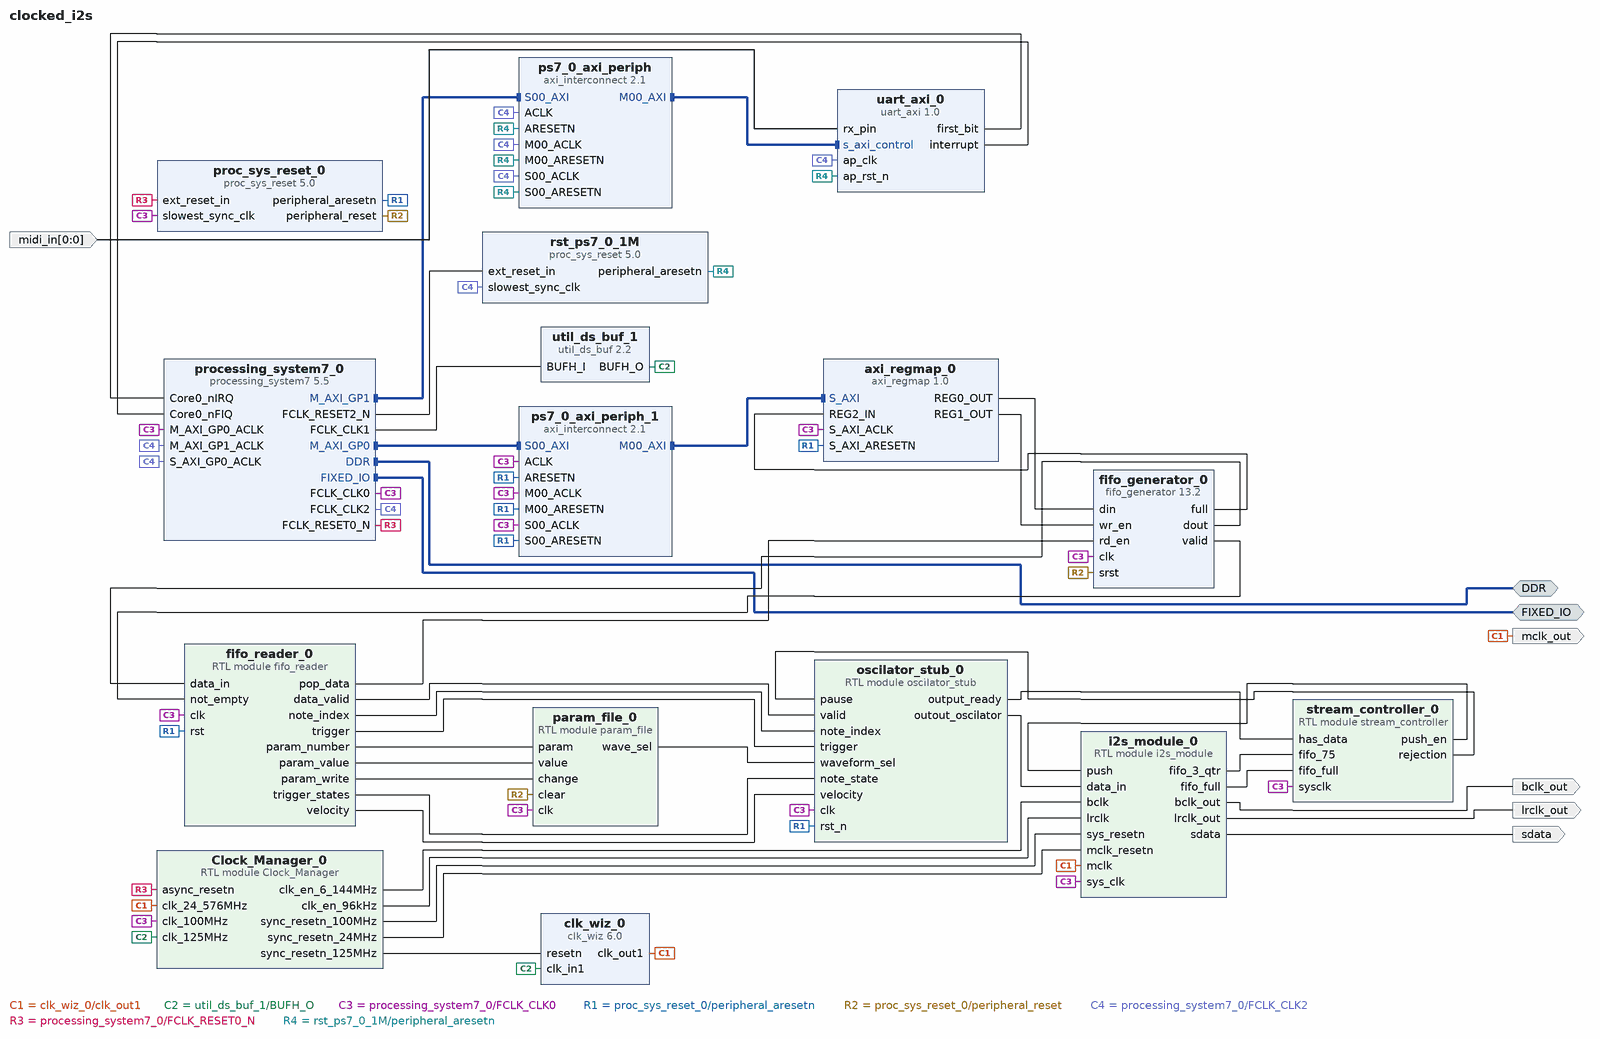
[diagram p0: block diagram of the top level]
# Vivado block design clocked_i2s, xc7z020clg400-1, Vivado 2021.1
create_bd_design clocked_i2s

create_bd_intf_port -mode Master -vlnv xilinx.com:interface:ddrx_rtl:1.0 DDR
create_bd_intf_port -mode Master -vlnv xilinx.com:display_processing_system7:fixedio_rtl:1.0 FIXED_IO
create_bd_port -dir O lrclk_out
create_bd_port -dir O bclk_out
create_bd_port -dir O sdata
create_bd_port -dir O -type clk mclk_out
create_bd_port -dir I -from 0 -to 0 -type data midi_in

create_bd_cell -type ip -vlnv xilinx.com:ip:clk_wiz:6.0 clk_wiz_0
set_property -dict [list \
  CONFIG.CLKIN1_JITTER_PS 80.0 \
  CONFIG.CLKOUT1_DRIVES BUFG \
  CONFIG.CLKOUT1_JITTER 554.143 \
  CONFIG.CLKOUT1_PHASE_ERROR 432.485 \
  CONFIG.CLKOUT1_REQUESTED_OUT_FREQ 24.57601 \
  CONFIG.FEEDBACK_SOURCE FDBK_AUTO \
  CONFIG.MMCM_CLKFBOUT_MULT_F 39.125 \
  CONFIG.MMCM_CLKIN1_PERIOD 8.000 \
  CONFIG.MMCM_CLKIN2_PERIOD 10.0 \
  CONFIG.MMCM_CLKOUT0_DIVIDE_F 24.875 \
  CONFIG.MMCM_DIVCLK_DIVIDE 8 \
  CONFIG.PRIM_IN_FREQ 125 \
  CONFIG.RESET_PORT resetn \
  CONFIG.RESET_TYPE ACTIVE_LOW \
  CONFIG.USE_LOCKED false \
] [get_bd_cells clk_wiz_0]
create_bd_cell -type ip -vlnv xilinx.com:ip:util_ds_buf:2.2 util_ds_buf_1
set_property -dict {CONFIG.C_BUF_TYPE BUFH} [get_bd_cells util_ds_buf_1]
create_bd_cell -type ip -vlnv xilinx.com:ip:processing_system7:5.5 processing_system7_0
set_property -dict [list \
  CONFIG.PCW_CORE0_FIQ_INTR 1 \
  CONFIG.PCW_CORE0_IRQ_INTR 1 \
  CONFIG.PCW_EN_CLK1_PORT 1 \
  CONFIG.PCW_EN_CLK2_PORT 1 \
  CONFIG.PCW_EN_RST2_PORT 1 \
  CONFIG.PCW_FCLK_CLK1_BUF TRUE \
  CONFIG.PCW_FCLK_CLK2_BUF TRUE \
  CONFIG.PCW_FPGA0_PERIPHERAL_FREQMHZ 100 \
  CONFIG.PCW_FPGA1_PERIPHERAL_FREQMHZ 125 \
  CONFIG.PCW_FPGA2_PERIPHERAL_FREQMHZ 1 \
  CONFIG.PCW_FPGA_FCLK1_ENABLE 1 \
  CONFIG.PCW_FPGA_FCLK2_ENABLE 1 \
  CONFIG.PCW_M_AXI_GP0_ENABLE_STATIC_REMAP 1 \
  CONFIG.PCW_M_AXI_GP0_THREAD_ID_WIDTH 6 \
  CONFIG.PCW_M_AXI_GP1_ENABLE_STATIC_REMAP 1 \
  CONFIG.PCW_M_AXI_GP1_THREAD_ID_WIDTH 6 \
  CONFIG.PCW_USE_FABRIC_INTERRUPT 1 \
  CONFIG.PCW_USE_M_AXI_GP1 1 \
  CONFIG.PCW_USE_S_AXI_GP0 1 \
] [get_bd_cells processing_system7_0]
# 30 more settings of processing_system7_0 are not shown: defaults, MIO pin electricals, DDR timing, and values the tool derives
create_bd_cell -type ip -vlnv xilinx.com:ip:proc_sys_reset:5.0 proc_sys_reset_0
create_bd_cell -type ip -vlnv xilinx.com:ip:fifo_generator:13.2 fifo_generator_0
set_property -dict [list \
  CONFIG.FIFO_Application_Type_rdch Data_FIFO \
  CONFIG.FIFO_Implementation_rach Common_Clock_Distributed_RAM \
  CONFIG.FIFO_Implementation_rdch Common_Clock_Distributed_RAM \
  CONFIG.FIFO_Implementation_wach Common_Clock_Distributed_RAM \
  CONFIG.FIFO_Implementation_wrch Common_Clock_Distributed_RAM \
  CONFIG.INTERFACE_TYPE Native \
  CONFIG.Input_Data_Width 16 \
  CONFIG.Input_Depth 32 \
  CONFIG.Input_Depth_rdch 32 \
  CONFIG.Output_Data_Width 16 \
  CONFIG.Performance_Options First_Word_Fall_Through \
  CONFIG.READ_WRITE_MODE READ_WRITE \
  CONFIG.Register_Slice_Mode_rdch Light_Weight \
  CONFIG.Reset_Type Synchronous_Reset \
  CONFIG.Use_Embedded_Registers false \
  CONFIG.Valid_Flag true \
  CONFIG.rach_type Pass_Through_Wire \
  CONFIG.rdch_type FIFO \
  CONFIG.wach_type Pass_Through_Wire \
  CONFIG.wdch_type Pass_Through_Wire \
  CONFIG.wrch_type Pass_Through_Wire \
] [get_bd_cells fifo_generator_0]
create_bd_cell -type ip -vlnv xilinx.com:ip:proc_sys_reset:5.0 rst_ps7_0_1M
create_bd_cell -type ip -vlnv xilinx.com:ip:axi_interconnect:2.1 ps7_0_axi_periph
set_property -dict {CONFIG.NUM_MI 1 CONFIG.NUM_SI 1} [get_bd_cells ps7_0_axi_periph]
create_bd_cell -type module -reference Clock_Manager Clock_Manager_0
create_bd_cell -type module -reference i2s_module i2s_module_0
create_bd_cell -type module -reference stream_controller stream_controller_0
create_bd_cell -type module -reference oscilator_stub oscilator_stub_0
create_bd_cell -type module -reference fifo_reader fifo_reader_0
create_bd_cell -type module -reference param_file param_file_0
create_bd_cell -type ip -vlnv xilinx.com:hls:uart_axi:1.0 uart_axi_0
create_bd_cell -type ip -vlnv SHREC:SHREC:axi_regmap:1.0 axi_regmap_0
set_property -dict {CONFIG.NUM_REGS 3 CONFIG.WIDTH0 16 CONFIG.WIDTH1 1 CONFIG.WIDTH2 1} [get_bd_cells axi_regmap_0]
create_bd_cell -type ip -vlnv xilinx.com:ip:axi_interconnect:2.1 ps7_0_axi_periph_1
set_property -dict {CONFIG.NUM_MI 1} [get_bd_cells ps7_0_axi_periph_1]

# ---- connections ----

connect_bd_intf_net [get_bd_intf_ports DDR] [get_bd_intf_pins processing_system7_0/DDR]
connect_bd_intf_net [get_bd_intf_ports FIXED_IO] [get_bd_intf_pins processing_system7_0/FIXED_IO]
connect_bd_intf_net [get_bd_intf_pins processing_system7_0/M_AXI_GP0] [get_bd_intf_pins ps7_0_axi_periph_1/S00_AXI]
connect_bd_intf_net [get_bd_intf_pins processing_system7_0/M_AXI_GP1] [get_bd_intf_pins ps7_0_axi_periph/S00_AXI]
connect_bd_intf_net [get_bd_intf_pins ps7_0_axi_periph_1/M00_AXI] [get_bd_intf_pins axi_regmap_0/S_AXI]
connect_bd_intf_net [get_bd_intf_pins ps7_0_axi_periph/M00_AXI] [get_bd_intf_pins uart_axi_0/s_axi_control]
connect_bd_net -net Clock_Manager_0_clk_en_12_288MHz [get_bd_pins Clock_Manager_0/clk_en_6_144MHz] [get_bd_pins i2s_module_0/bclk]
connect_bd_net [get_bd_pins Clock_Manager_0/clk_en_96kHz] [get_bd_pins i2s_module_0/lrclk]
connect_bd_net [get_bd_pins Clock_Manager_0/sync_resetn_100MHz] [get_bd_pins i2s_module_0/sys_resetn]
connect_bd_net [get_bd_pins Clock_Manager_0/sync_resetn_125MHz] [get_bd_pins clk_wiz_0/resetn]
connect_bd_net [get_bd_pins Clock_Manager_0/sync_resetn_24MHz] [get_bd_pins i2s_module_0/mclk_resetn]
connect_bd_net [get_bd_pins axi_regmap_0/REG0_OUT] [get_bd_pins fifo_generator_0/din]
connect_bd_net [get_bd_pins axi_regmap_0/REG1_OUT] [get_bd_pins fifo_generator_0/wr_en]
connect_bd_net [get_bd_pins clk_wiz_0/clk_out1] [get_bd_ports mclk_out] [get_bd_pins Clock_Manager_0/clk_24_576MHz] [get_bd_pins i2s_module_0/mclk]
connect_bd_net -net clk_wiz_1_clk_out1 [get_bd_pins util_ds_buf_1/BUFH_O] [get_bd_pins clk_wiz_0/clk_in1] [get_bd_pins Clock_Manager_0/clk_125MHz]
connect_bd_net [get_bd_pins fifo_generator_0/dout] [get_bd_pins fifo_reader_0/data_in]
connect_bd_net [get_bd_pins fifo_generator_0/full] [get_bd_pins axi_regmap_0/REG2_IN]
connect_bd_net [get_bd_pins fifo_generator_0/valid] [get_bd_pins fifo_reader_0/not_empty]
connect_bd_net [get_bd_pins fifo_reader_0/data_valid] [get_bd_pins oscilator_stub_0/valid]
connect_bd_net [get_bd_pins fifo_reader_0/note_index] [get_bd_pins oscilator_stub_0/note_index]
connect_bd_net [get_bd_pins fifo_reader_0/param_number] [get_bd_pins param_file_0/param]
connect_bd_net [get_bd_pins fifo_reader_0/param_value] [get_bd_pins param_file_0/value]
connect_bd_net [get_bd_pins fifo_reader_0/param_write] [get_bd_pins param_file_0/change]
connect_bd_net [get_bd_pins fifo_reader_0/pop_data] [get_bd_pins fifo_generator_0/rd_en]
connect_bd_net [get_bd_pins fifo_reader_0/trigger] [get_bd_pins oscilator_stub_0/trigger]
connect_bd_net [get_bd_pins fifo_reader_0/trigger_states] [get_bd_pins oscilator_stub_0/note_state]
connect_bd_net [get_bd_pins fifo_reader_0/velocity] [get_bd_pins oscilator_stub_0/velocity]
connect_bd_net [get_bd_pins i2s_module_0/bclk_out] [get_bd_ports bclk_out]
connect_bd_net [get_bd_pins i2s_module_0/fifo_3_qtr] [get_bd_pins stream_controller_0/fifo_75]
connect_bd_net [get_bd_pins i2s_module_0/fifo_full] [get_bd_pins stream_controller_0/fifo_full]
connect_bd_net [get_bd_pins i2s_module_0/lrclk_out] [get_bd_ports lrclk_out]
connect_bd_net [get_bd_pins i2s_module_0/sdata] [get_bd_ports sdata]
connect_bd_net [get_bd_pins oscilator_stub_0/outout_oscilator] [get_bd_pins i2s_module_0/data_in]
connect_bd_net [get_bd_pins oscilator_stub_0/output_ready] [get_bd_pins stream_controller_0/has_data]
connect_bd_net [get_bd_pins param_file_0/wave_sel] [get_bd_pins oscilator_stub_0/waveform_sel]
connect_bd_net -net pl_clk_1 [get_bd_pins processing_system7_0/FCLK_CLK0] \
  [get_bd_pins processing_system7_0/M_AXI_GP0_ACLK] [get_bd_pins proc_sys_reset_0/slowest_sync_clk] \
  [get_bd_pins Clock_Manager_0/clk_100MHz] [get_bd_pins i2s_module_0/sys_clk] [get_bd_pins stream_controller_0/sysclk] \
  [get_bd_pins oscilator_stub_0/clk] [get_bd_pins fifo_reader_0/clk] [get_bd_pins param_file_0/clk] \
  [get_bd_pins fifo_generator_0/clk] [get_bd_pins ps7_0_axi_periph_1/S00_ACLK] [get_bd_pins axi_regmap_0/S_AXI_ACLK] \
  [get_bd_pins ps7_0_axi_periph_1/M00_ACLK] [get_bd_pins ps7_0_axi_periph_1/ACLK]
connect_bd_net [get_bd_pins proc_sys_reset_0/peripheral_aresetn] \
  [get_bd_pins oscilator_stub_0/rst_n] [get_bd_pins fifo_reader_0/rst] [get_bd_pins ps7_0_axi_periph_1/S00_ARESETN] \
  [get_bd_pins axi_regmap_0/S_AXI_ARESETN] [get_bd_pins ps7_0_axi_periph_1/M00_ARESETN] \
  [get_bd_pins ps7_0_axi_periph_1/ARESETN]
connect_bd_net [get_bd_pins proc_sys_reset_0/peripheral_reset] [get_bd_pins param_file_0/clear] [get_bd_pins fifo_generator_0/srst]
connect_bd_net [get_bd_pins processing_system7_0/FCLK_CLK1] [get_bd_pins util_ds_buf_1/BUFH_I]
connect_bd_net [get_bd_pins processing_system7_0/FCLK_CLK2] \
  [get_bd_pins processing_system7_0/M_AXI_GP1_ACLK] [get_bd_pins processing_system7_0/S_AXI_GP0_ACLK] \
  [get_bd_pins rst_ps7_0_1M/slowest_sync_clk] [get_bd_pins ps7_0_axi_periph/S00_ACLK] [get_bd_pins ps7_0_axi_periph/M00_ACLK] \
  [get_bd_pins ps7_0_axi_periph/ACLK] [get_bd_pins uart_axi_0/ap_clk]
connect_bd_net [get_bd_pins processing_system7_0/FCLK_RESET0_N] [get_bd_pins proc_sys_reset_0/ext_reset_in] [get_bd_pins Clock_Manager_0/async_resetn]
connect_bd_net [get_bd_pins processing_system7_0/FCLK_RESET2_N] [get_bd_pins rst_ps7_0_1M/ext_reset_in]
connect_bd_net [get_bd_pins rst_ps7_0_1M/peripheral_aresetn] \
  [get_bd_pins ps7_0_axi_periph/S00_ARESETN] [get_bd_pins ps7_0_axi_periph/M00_ARESETN] \
  [get_bd_pins ps7_0_axi_periph/ARESETN] [get_bd_pins uart_axi_0/ap_rst_n]
connect_bd_net -net rx_pin_0_1 [get_bd_ports midi_in] [get_bd_pins uart_axi_0/rx_pin]
connect_bd_net [get_bd_pins stream_controller_0/push_en] [get_bd_pins i2s_module_0/push]
connect_bd_net [get_bd_pins stream_controller_0/rejection] [get_bd_pins oscilator_stub_0/pause]
connect_bd_net [get_bd_pins uart_axi_0/first_bit] [get_bd_pins processing_system7_0/Core0_nIRQ]
connect_bd_net [get_bd_pins uart_axi_0/interrupt] [get_bd_pins processing_system7_0/Core0_nFIQ]

# ---- address map ----
assign_bd_address -offset 0x70000000 -range 64K -target_address_space [get_bd_addr_spaces processing_system7_0/Data] [get_bd_addr_segs axi_regmap_0/S_AXI/reg0]
assign_bd_address -offset 0x80000000 -range 64K -target_address_space [get_bd_addr_spaces processing_system7_0/Data] [get_bd_addr_segs uart_axi_0/s_axi_control/Reg]

validate_bd_design
save_bd_design
